# EAGLE schematic Leaf_485_Micro_BrO (EAGLE 7.3.0)
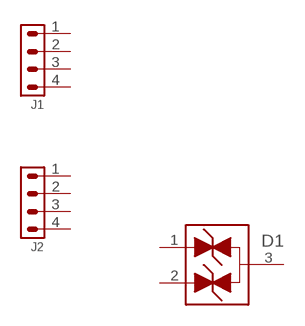
[diagram p0: schematic, sheet 1]

## Parts
D1  TVS_SOT-23  [SOT-23_ONSEMI]
J1  CONN_4X1_LEAF_SMT  [CONN_4X1_LEAF_SMT]
J2  CONN_4X1_LEAF_SMT  [CONN_4X1_LEAF_SMT]
Unconnected: D1.1 D1.2 D1.3 J1.1 J1.2 J1.3 J1.4 J2.1 J2.2 J2.3 J2.4

## Library data of the parts
D1 = leaf:TVS_SOT-23
J1 J2 = leaf:CONN_4X1_LEAF_SMT